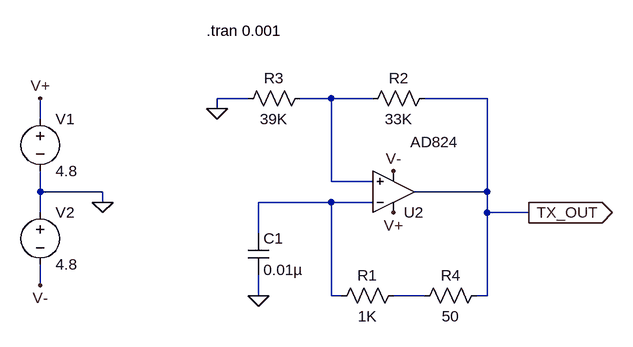
[diagram p0: schematic Transmitter2.asc]
Transmitter2.asc, the LTspice schematic file:
Version 4
SHEET 1 880 680
WIRE -48 48 -96 48
WIRE 80 48 32 48
WIRE 144 48 80 48
WIRE 320 48 224 48
WIRE -96 64 -96 48
WIRE -368 80 -368 48
WIRE 80 176 80 48
WIRE 144 176 80 176
WIRE -368 192 -368 160
WIRE -272 192 -368 192
WIRE 320 192 320 48
WIRE 320 192 208 192
WIRE -272 208 -272 192
WIRE 80 208 -32 208
WIRE 144 208 80 208
WIRE -368 224 -368 192
WIRE 320 224 320 192
WIRE 384 224 320 224
WIRE -32 256 -32 208
WIRE -368 336 -368 304
WIRE -32 352 -32 320
WIRE 80 352 80 208
WIRE 96 352 80 352
WIRE 224 352 176 352
WIRE 320 352 320 224
WIRE 320 352 304 352
FLAG -32 352 0
FLAG -96 64 0
FLAG -272 208 0
FLAG -368 48 V+
FLAG 176 224 V+
FLAG -368 336 V-
FLAG 176 160 V-
FLAG 384 224 TX_OUT
IOPIN 384 224 Out
SYMBOL cap -48 256 R0
SYMATTR InstName C1
SYMATTR Value 0.01µ
SYMATTR SpiceLine V=10 Irms=0 Rser=0 Lser=0 mfg="Murata" pn="GRM033R71A103KA01" type="X7R"
SYMBOL res 192 336 R90
WINDOW 0 0 56 VBottom 2
WINDOW 3 32 56 VTop 2
SYMATTR InstName R1
SYMATTR Value 1K
SYMATTR SpiceLine tol=1 pwr=0.1
SYMBOL res 240 32 R90
WINDOW 0 0 56 VBottom 2
WINDOW 3 32 56 VTop 2
SYMATTR InstName R2
SYMATTR Value 33K
SYMBOL res 48 32 R90
WINDOW 0 0 56 VBottom 2
WINDOW 3 32 56 VTop 2
SYMATTR InstName R3
SYMATTR Value 39K
SYMBOL voltage -368 64 R0
WINDOW 123 0 0 Left 0
WINDOW 39 0 0 Left 0
SYMATTR InstName V1
SYMATTR Value 4.8
SYMBOL voltage -368 208 R0
WINDOW 123 0 0 Left 0
WINDOW 39 0 0 Left 0
SYMATTR InstName V2
SYMATTR Value 4.8
SYMBOL res 320 336 R90
WINDOW 0 0 56 VBottom 2
WINDOW 3 32 56 VTop 2
SYMATTR InstName R4
SYMATTR Value 50
SYMBOL Opamps\\AD824 176 256 M180
WINDOW 3 26 141 Left 2
SYMATTR InstName U2
TEXT -112 -56 Left 2 !.tran 0.001

The netlist it stands for:
* Transmitter2.asc
C1 N002 0 0.01µ V=10 Irms=0 Rser=0 Lser=0 mfg="Murata" pn="GRM033R71A103KA01" type="X7R"
R1 N003 N002 1K tol=1 pwr=0.1
R2 TX_OUT N001 33K
R3 N001 0 39K
V1 V+ 0 4.8
V2 0 V- 4.8
R4 TX_OUT N003 50
XU2 N001 N002 V+ V- TX_OUT AD824  ; pins In+ In- V+ V- OUT
.tran 0.001
.backanno
.end